# EAGLE design memoryboard4 (EAGLE 7.3.0)
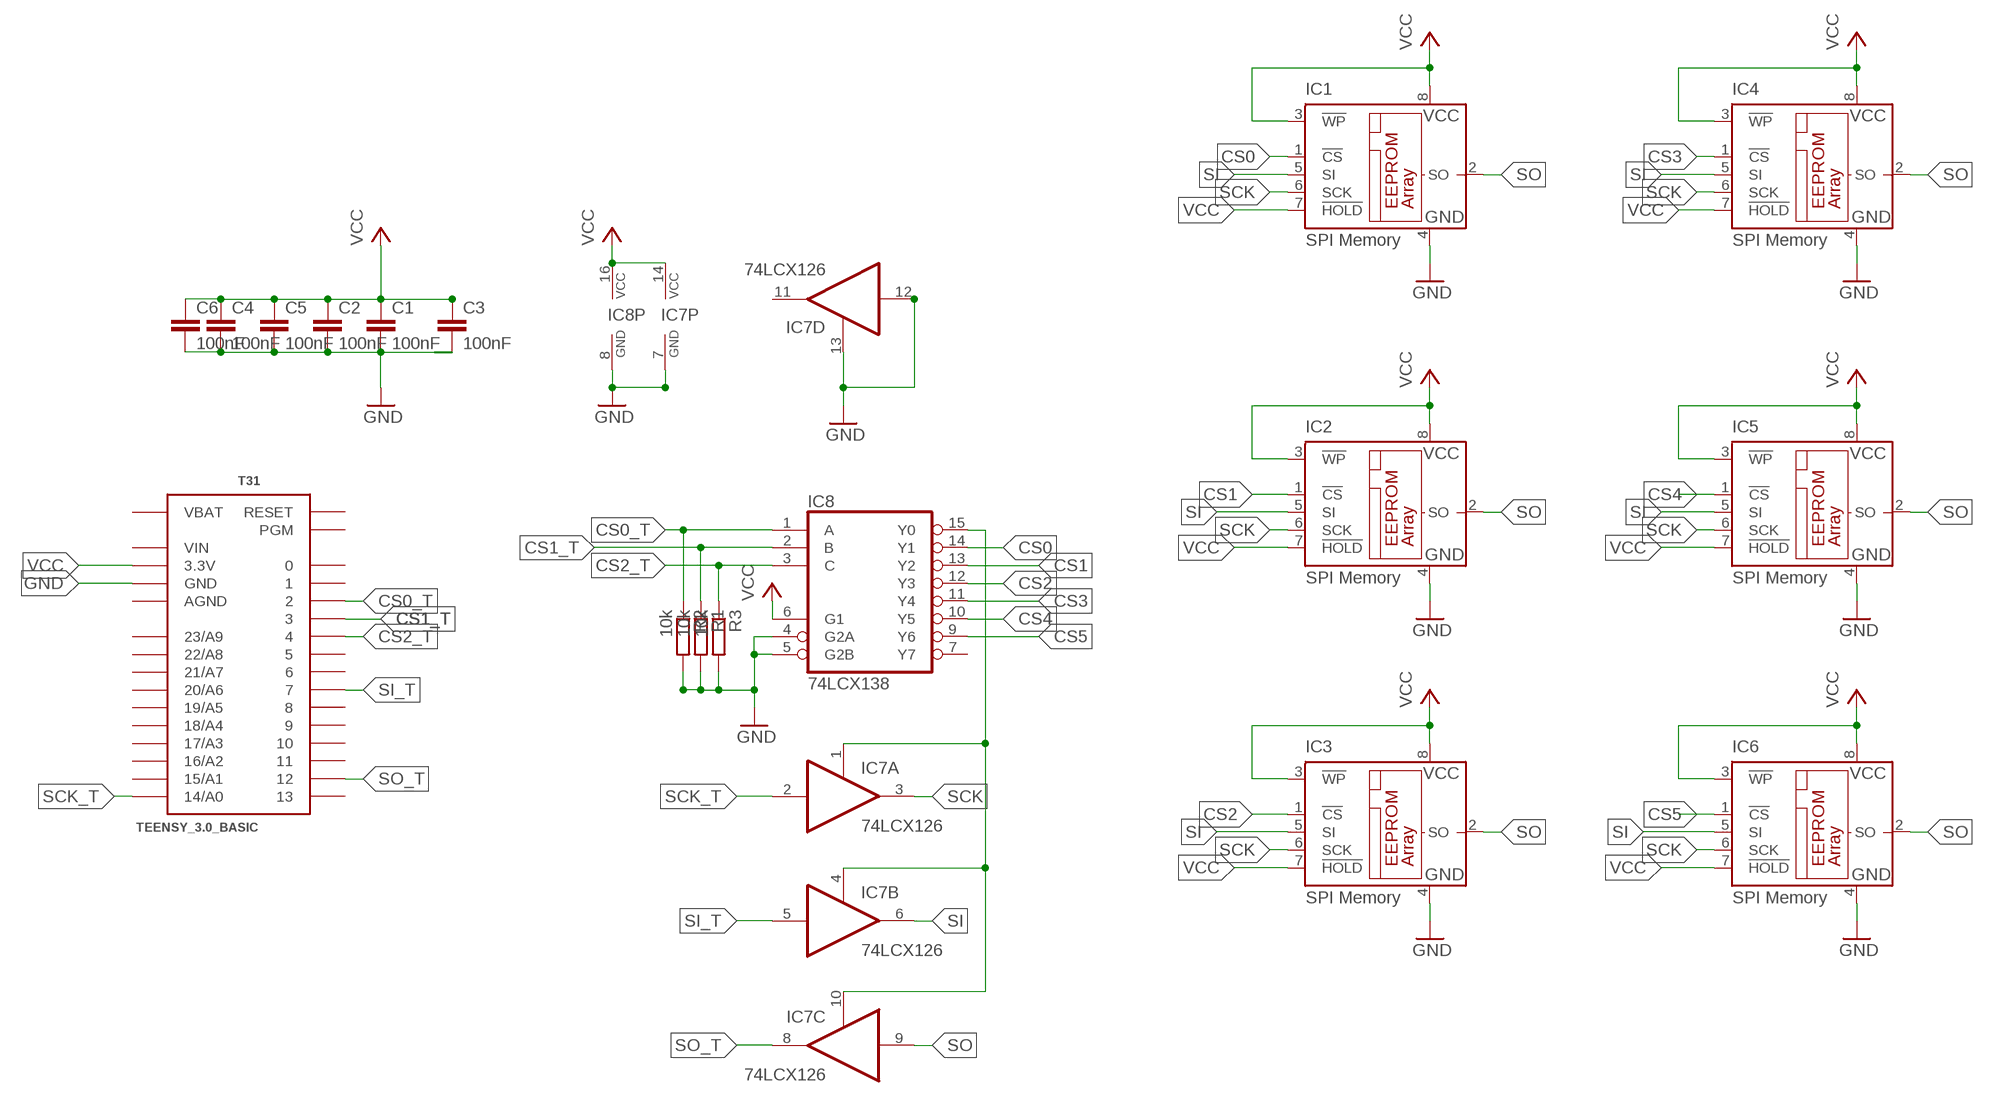
[diagram p0: schematic, sheet 1]

## Parts
C1  100nF  C-EUC0603  [C0603]
C2  100nF  C-EUC0603  [C0603]
C3  100nF  C-EUC0603  [C0603]
C4  100nF  C-EUC0603  [C0603]
C5  100nF  C-EUC0603  [C0603]
C6  100nF  C-EUC0603  [C0603]
IC1  SPI Memory  25C080SN  [SO-08]
IC2  SPI Memory  25C080SN  [SO-08]
IC3  SPI Memory  25C080SN  [SO-08]
IC4  SPI Memory  25C080SN  [SO-08]
IC5  SPI Memory  25C080SN  [SO-08]
IC6  SPI Memory  25C080SN  [SO-08]
IC7  74LCX126  74AC126D  [SO14]
IC8  74LCX138  74HC138D  [SO16]
R1  10k  R-EU_R0603  [R0603]
R2  10k  R-EU_R0603  [R0603]
R3  10k  R-EU_R0603  [R0603]
T31  TEENSY_3.0_BASIC  [TEENSY_3.0_BASIC]

## Nets
CS0: IC1.1(!CS) IC8.14(Y1)
CS0_T [SLOW]: IC8.1(A) R2.1 T31.2
CS1: IC2.1(!CS) IC8.13(Y2)
CS1_T [SLOW]: IC8.2(B) R1.1 T31.3
CS2: IC3.1(!CS) IC8.12(Y3)
CS2_T [SLOW]: IC8.3(C) R3.1 T31.4
CS3: IC4.1(!CS) IC8.11(Y4)
CS4: IC5.1(!CS) IC8.10(Y5)
CS5: IC6.1(!CS) IC8.9(Y6)
GND [SUPPLY]: C1.2 C2.2 C3.2 C4.2 C5.2 C6.2 IC1.4(GND) IC2.4(GND) IC3.4(GND) IC4.4(GND) IC5.4(GND) IC6.4(GND) IC7.7(P:GND) IC7.12(D:I) IC7.13(D:OE) IC8.4(G2A) IC8.5(G2B) IC8.8(GND) R1.2 R2.2 R3.2 T31.GND T31.GND1(GND)
SCK: IC1.6(SCK) IC2.6(SCK) IC3.6(SCK) IC4.6(SCK) IC5.6(SCK) IC6.6(SCK) IC7.3(A:O)
SCK_T: IC7.2(A:I) T31.14/A0
SI: IC1.5(SI) IC2.5(SI) IC3.5(SI) IC4.5(SI) IC5.5(SI) IC6.5(SI) IC7.6(B:O)
SI_T: IC7.5(B:I) T31.7
SO: IC1.2(SO) IC2.2(SO) IC3.2(SO) IC4.2(SO) IC5.2(SO) IC6.2(SO) IC7.9(C:I)
SO_T: IC7.8(C:O) T31.12
SPI_ENABLE: IC7.1(A:OE) IC7.4(B:OE) IC7.10(C:OE) IC8.15(Y0)
VCC [SUPPLY]: C1.1 C2.1 C3.1 C4.1 C5.1 C6.1 IC1.3(!WP) IC1.7(!HOLD) IC1.8(VCC) IC2.3(!WP) IC2.7(!HOLD) IC2.8(VCC) IC3.3(!WP) IC3.7(!HOLD) IC3.8(VCC) IC4.3(!WP) IC4.7(!HOLD) IC4.8(VCC) IC5.3(!WP) IC5.7(!HOLD) IC5.8(VCC) IC6.3(!WP) IC6.7(!HOLD) IC6.8(VCC) IC7.14(P:VCC) IC8.6(G1) IC8.16(VCC) T31.3.3V T31.3.3V1(3.3V)
Unconnected: IC7.11(D:O) IC8.7(Y7) T31.0 T31.1 T31.5 T31.6 T31.8 T31.9 T31.10 T31.11 T31.13 T31.15/A1 T31.16/A2 T31.17/A3 T31.18/A4 T31.19/A5 T31.20/A6 T31.21/A7 T31.22/A8 T31.23/A9 T31.PGM T31.RESET

## Power pins joined to a net without a drawn wire
AGND: T31.AGND
VBAT: T31.VBAT
VIN: T31.VIN

## Library data of the parts
C1-C6 = resistor:C-EU: CAPACITOR, European symbol
IC1-IC6 = microchip:25*: Serial EEPROM 4K/ 8K , SPI bus; MF: MICROCHIP; MPN: 25C080/SN; OC_FARNELL: unknown; OC_NEWARK: 96K4086
IC7 = 74xx-eu:74*126: Quad bus BUFFER, 3-state
IC8 = 74xx-eu:74*138: 3-line to 8-line DECODER/DEMULTIPLEXER
R1-R3 = resistor:R-EU_: RESISTOR, European symbol
T31 = Teensy_3_Series_Board_v1.0:TEENSY_3.0_BASIC: Basic Teensy 3.0 with none of the 'inner' pins enabled. See '+4', 'AllAnalogPins", and 'AllPins' packages for additional pin holes, as needed.

## Net classes
0 default: clearance 0.205 mm
1 SUPPLY: width 0.254 mm
2 SLOW: width 0.152 mm

## Board
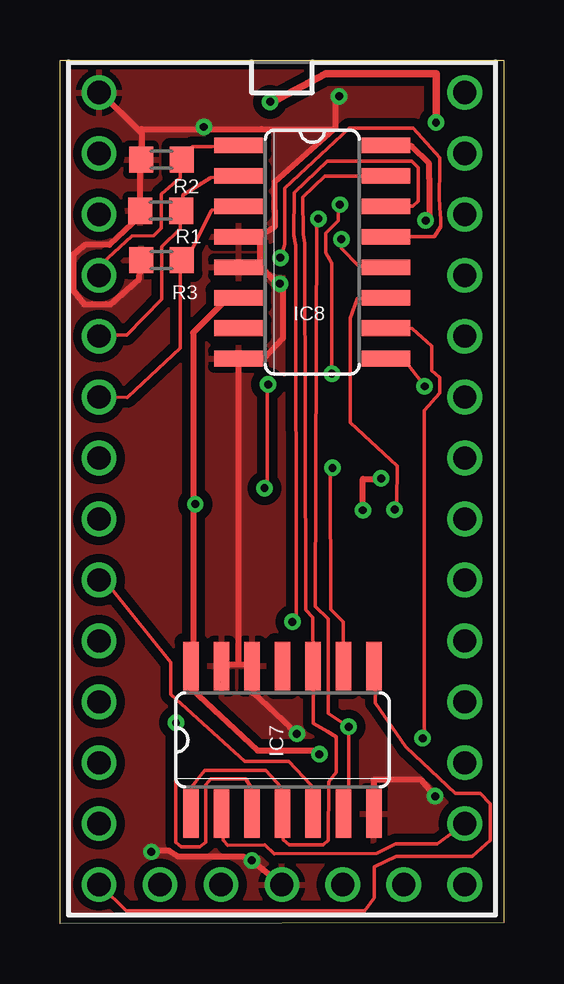
[diagram p1: board, top side]
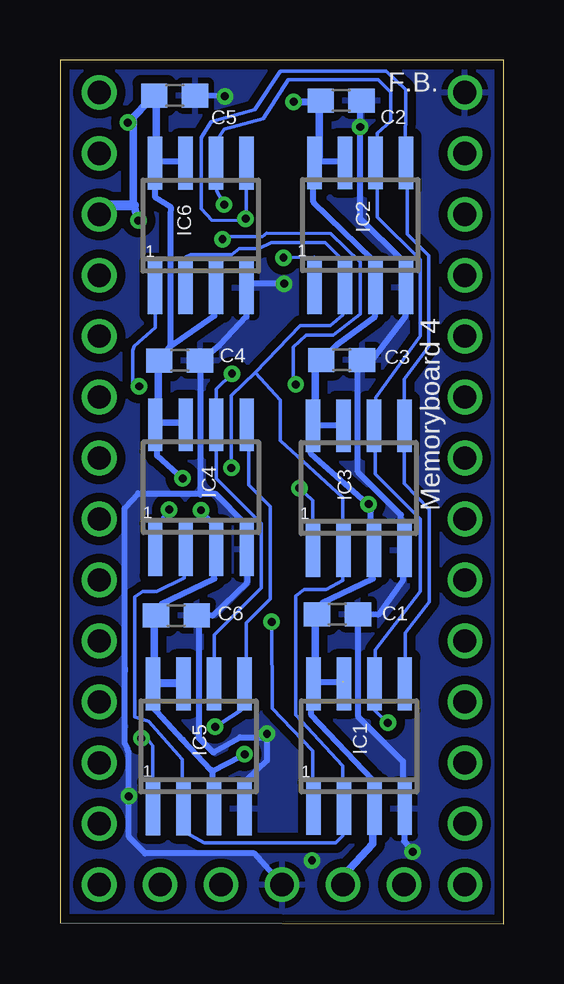
[diagram p2: board, bottom side, seen from below]

Size 18.5 x 36.02 mm. Coordinates in mm from the lower left corner, seen from the top.
Outline: 0,36.01 18.48,36.02 18.5,0.05 0.01,0 0,36.01
Copper layers (1*16): Top 0.0356mm / dielectric 1.5011mm / Bottom 0.0356mm
Design rules "LaenPCBOrder *": minimum track width 6mil, minimum drill 13mil, track to track 6mil, track to pad 6mil, pad to pad 8mil, via to via 6mil, smd to smd 6mil, copper to edge 15mil, drill to drill 6mil, minimum pad ring 7mil, minimum via ring 7mil, stop-mask expansion 3mil, vias tented up to drill 25mil, thermal gap 10mil

### Footprints (pad centres in the part's own frame; a part is rotated, then mirrored left to right if it is on the bottom)
C0603 = smd 1.1 x 1: 1 -0.85,0; 2 0.85,0
SO-08 = smd 0.6 x 2.2: 1 -1.905,-2.6; 2 -0.635,-2.6; 3 0.635,-2.6; 4 1.905,-2.6; 5 1.905,2.6; 6 0.635,2.6; 7 -0.635,2.6; 8 -1.905,2.6
SO14 = smd 0.66 x 2.032: 1 -3.81,-3.073; 2 -2.54,-3.073; 3 -1.27,-3.073; 4 0,-3.073; 5 1.27,-3.073; 6 2.54,-3.073; 7 3.81,-3.073; 8 3.81,3.073; 9 2.54,3.073; 10 1.27,3.073; 11 0,3.073; 12 -1.27,3.073; 13 -2.54,3.073; 14 -3.81,3.073
SO16 = smd 0.66 x 2.032: 1 -4.445,-3.073; 2 -3.175,-3.073; 3 -1.905,-3.073; 4 -0.635,-3.073; 5 0.635,-3.073; 6 1.905,-3.073; 7 3.175,-3.073; 8 4.445,-3.073; 9 4.445,3.073; 10 3.175,3.073; 11 1.905,3.073; 12 0.635,3.073; 13 -0.635,3.073; 14 -1.905,3.073; 15 -3.175,3.073; 16 -4.445,3.073
R0603 = smd 1 x 1.1: 1 -0.85,0; 2 0.85,0
TEENSY_3.0_BASIC = drill 0.965: 0 -7.62,13.97; 1 -7.62,11.43; 2 -7.62,8.89; 3 -7.62,6.35; 3.3V 7.62,11.43; 3.3V1 -2.54,-16.51; 4 -7.62,3.81; 5 -7.62,1.27; 6 -7.62,-1.27; 7 -7.62,-3.81; 8 -7.62,-6.35; 9 -7.62,-8.89; 10 -7.62,-11.43; 11 -7.62,-13.97; 12 -7.62,-16.51; 13 7.62,-16.51; 14/A0 7.62,-13.97; 15/A1 7.62,-11.43; 16/A2 7.62,-8.89; 17/A3 7.62,-6.35; 18/A4 7.62,-3.81; 19/A5 7.62,-1.27; 20/A6 7.62,1.27; 21/A7 7.62,3.81; 22/A8 7.62,6.35; 23/A9 7.62,8.89; AGND 7.62,13.97; GND -7.62,16.51; GND1 0,-16.51; PGM 2.54,-16.51; RESET 5.08,-16.51; VBAT -5.08,-16.51; VIN 7.62,16.51

### Placement (x,y rotation side)
C1  6.94,12.91 0 bottom
C2  6.78,34.33 0 bottom
C3  6.76,23.52 0 bottom
C4  13.51,23.48 0 bottom
C5  13.72,34.53 0 bottom
C6  13.65,12.85 0 bottom
IC1  6.04,7.41 0 bottom
IC2  5.98,29.13 0 bottom
IC3  6.05,18.17 0 bottom
IC4  12.62,18.21 0 bottom
IC5  12.72,7.4 0 bottom
IC6  12.63,29.11 0 bottom
IC7  9.27,7.67 0 top
IC8  10.51,28.01 270 top
R1  4.2,29.73 180 top
R2  4.23,31.86 180 top
R3  4.23,27.67 180 top
T31  9.25,18.15 0 top

### Tracks (layer width: path | path; a pad name or v marks a point on that pad's centre or on a via)
CS0  (via drill 0.33)
  Top 0.152: v9.68,12.6 9.83,12.78 9.82,28.28 9.75,28.71 9.76,30.48 11.13,31.8 14.66,31.8 14.93,31.53 14.93,30.14 14.71,29.92 IC8.14
  Bottom 0.152: v9.68,12.6 9.66,8.99 7.96,7.21 7.96,4.81 IC1.1
CS0_T
  Top 0.152: IC8.1 7.42,32.42 6.33,32.4 5.51,32.4 R2.1 5.01,31.8 5.01,31.12 4.22,30.43 4.22,29 3.91,28.7 2.98,28.67 1.73,27.52 1.7,27.06 T31.2
CS1  (via drill 0.33)
  Top 0.152: v9.18,27.78 9.34,28.26 9.37,28.33 9.36,30.67 12.06,33.16 14.72,33.16 15.82,31.94 15.82,31.48 15.81,30.32 15.81,29.86 15.87,29.38 15.87,29.2 15.87,29.07 15.6,28.66 13.51,28.66 IC8.13
  Bottom 0.152: v9.18,27.78 7.91,27.8 IC2.1
CS1_T
  Top 0.152: IC8.2 7.42,31.17 6.29,31.12 5.12,30.38 5.1,29.74 R1.1 5.01,29.65 5.01,28.98 4.24,28.24 4.24,26.06 2.79,24.55 2.08,24.55 1.7,24.56 T31.3
CS2  (via drill 0.33)
  Top 0.152: v11.73,28.55 11.73,28.28 11.73,28.17 12.46,27.42 13.5,27.42 IC8.12 | v8.52,18.17 8.61,18.27 8.63,18.4 8.63,22.11 v8.67,22.49
  Bottom 0.152: v11.73,28.55 11.73,28.66 10.08,28.66 9.88,28.79 7.22,28.77 5.99,27.6 5.99,25.43 7.12,24.56 8.24,24.56 8.78,24.05 8.78,22.79 v8.67,22.49 | v8.52,18.17 7.96,17.66 7.96,15.63 IC3.1
CS2_T
  Top 0.152: IC8.3 7.42,29.83 6.33,29.76 5.4,27.94 5.1,27.69 R3.1 5.01,27.6 5.01,24.01 2.8,21.95 1.7,21.97 T31.4
CS3  (via drill 0.33)
  Top 0.152: v13.95,17.27 14.04,17.56 14.05,19.08 12.1,20.91 12.1,25.26 12.38,26.08 13.5,26.08 IC8.11
  Bottom 0.152: v13.95,17.27 14.45,16.64 14.48,15.63 IC4.1
CS4  (via drill 0.33)
  Top 0.152: v15.11,7.74 15.19,8.02 15.18,21.4 15.82,22.12 15.82,22.79 15.49,23.07 15.49,24.09 14.67,24.82 14.06,24.84 13.59,24.92 IC8.10
  Bottom 0.152: v15.11,7.74 14.88,7.75 14.63,7.43 IC5.1
CS5  (via drill 0.33)
  Top 0.152: v15.2,22.41 14.3,23.58 IC8.9
  Bottom 0.152: v15.2,22.41 15.46,22.54 15.46,23.91 15.4,24.08 14.52,24.86 IC6.1
GND  (via drill 0.33)
  Top 0.254: 7.42,10.8 7.96,10.8 IC7.12 8.05,10.71 8.05,9.63 9.59,8.19 v9.87,7.93 | 7.42,10.8 6.8,10.8 IC7.13 | 9.28,26.47 9.28,24.41 8.5,23.58 7.51,23.58 IC8.8 7.42,23.49 7.42,10.8 | 9.28,26.47 8.4,27.33 7.51,27.33 IC8.5 8.34,27.45 8.34,28.61 IC8.4 7.51,28.67 8.35,28.67 8.94,29.06 8.94,30.49 8.94,30.92 11.4,33.14 | v9.16,26.69 v9.14,26.69 9.28,26.47 | R3.2 3.31,27.6 3.31,27.24 3.3,26.88 2.11,25.84 1,25.84 0.54,26.4 0.54,27.9 1.06,28.31 2.06,28.31 3.32,29.5 R1.2 3.31,29.74 3.31,31.8 R2.2 3.4,31.98 3.4,32.96 3.31,33.05 | 3.31,33.05 1.7,34.66 T31.GND | 11.4,33.14 8.41,33.14 5.99,33.14 | 5.99,33.14 3.4,33.14 3.31,33.05 | v15.63,5.32 15.04,6.01 13.06,6.01 IC7.7 | v5.99,33.23 5.99,33.14 | v3.8,3.01 3.96,3.06 4.54,3.06 4.92,2.8 7.64,2.8 v8,2.65 T31.GND1 | v11.63,34.5 11.48,34.28 11.48,33.18 11.4,33.14
  Bottom 0.254: v9.87,7.93 9.88,6.82 10.73,6 10.73,4.81 IC5.4 | v9.16,26.69 10.74,26.69 IC6.4 10.73,26.44 10.73,25.32 11.84,24.13 12.6,23.49 C4.2 12.64,17.89 | 12.6,34.39 C5.2 v11.63,34.5 | 1.7,34.75 T31.GND | v15.63,5.32 15.63,3.64 14.95,2.94 10.4,2.94 9.3,1.69 T31.GND1 9.12,1.6 | 15.64,5.34 15.64,7.15 15.69,7.32 15.81,7.54 15.81,8.29 15.8,9.67 15.8,10.68 15.81,10.5 15.81,17.33 15.24,17.95 12.6,17.95 12.03,17.94 10.78,16.68 10.73,15.71 IC4.4 10.73,15.54 10.7,14.24 12.15,12.84 12.76,12.85 C6.2 12.72,12.65 12.72,7.76 12.11,7.15 10.99,7.78 9.98,7.78 | C2.2 5.99,34.3 v5.99,33.23 5.99,29.41 4.23,27.67 4.21,26.62 IC2.4 4.12,26.53 4.12,25.32 5.47,23.55 6.08,23.55 C3.2 6.08,23.31 6.08,18.84 4.3,17.06 4.3,15.63 IC3.4 4.21,15.54 4.21,14.33 5.24,12.88 5.55,12.89 C1.2 6.08,12.59 6.08,8.66 4.21,6.78 4.21,4.81 IC1.4 4.2,4.77 | 4.3,4.72 4.2,4.77 | 4.2,4.77 4.16,3.46 v3.8,3.01
  pour Top (isolate 0.356): 0.07,35.93 18.28,35.87 18.26,0.29 0.12,0.16
  pour Bottom (isolate 0.356): 0.1,35.9 18.31,35.9 18.31,0.14 0.2,0.14
SCK  (via drill 0.33)
  Top 0.152: v4.83,8.39 4.83,3.41 5.05,3.22 5.81,3.22 6.08,3.41 6.08,5.8 6.29,6.05 7.74,6.05 7.96,5.68 7.96,4.64 IC7.3 | v11.66,29.99 11.6,29.83 11.6,29.32 11.07,28.79 11.07,27.98 11.32,27.54 v11.33,22.94
  Bottom 0.152: IC5.6 12.07,10.09 12.07,12.05 10.1,14.02 10.1,16.7 11.98,18.57 IC4.6 11.98,20.9 11.98,22.29 v11.33,22.94 | v4.83,8.39 5.39,8.9 5.37,10 IC1.6 5.37,10.09 5.37,11.43 3.49,13.86 3.49,16.88 5.37,18.75 5.37,20.72 IC3.6 5.37,20.81 5.34,21.94 3.49,24.5 3.49,27.69 5.28,29.47 5.28,31.71 IC2.6 5.28,31.8 5.28,32.98 4.72,33.46 4.72,34.68 5.23,35.19 8.99,35.19 10.03,33.56 11.65,33.13 11.9,32.76 11.98,31.8 IC6.6 11.98,31.71 11.96,30.55 v11.66,29.99
SCK_T
  Top 0.152: IC7.2 6.8,4.55 6.8,3.48 6.98,3.29 8.53,3.29 8.94,2.93 13.21,2.94 13.99,3.34 15.59,3.34 15.72,3.34 T31.14/A0
SI  (via drill 0.33)
  Top 0.152: IC7.6 11.8,4.64 12.03,4.64 12.03,6.08 v12.03,8.22 11.81,8.37 11.17,8.77 11.17,12.71 10.64,13.24 10.69,29.3 v10.76,29.4
  Bottom 0.152: v12.03,8.22 11.96,8.27 11.8,8.36 10.97,8.9 10.97,9.55 10.82,9.55 10.82,10 IC5.5 10.73,10.09 10.73,12.55 9.75,13.56 9.75,17.41 10.64,18.3 10.64,20.81 IC4.5 | IC1.5 4.12,10.09 4.12,12.14 3.11,13.43 3.11,17.27 4.14,18.36 IC3.5 4.14,22.71 3.13,24.08 3.13,27.87 4.03,28.76 4.03,31.71 IC2.5 4.12,31.8 4.09,34.77 4.9,35.55 9.33,35.55 10.38,33.94 12.19,33.44 12.6,32.78 12.6,29.81 12.18,29.34 10.99,29.32 10.78,29.36 10.72,29.43 | 10.72,29.43 10.73,29.92 IC6.5 | v10.76,29.4 10.72,29.43
SI_T
  Top 0.152: IC7.5 10.46,4.64 10.46,5.77 9.52,6.78 7.7,6.78 4.62,9.56 4.62,10.91 2.13,13.98 1.8,14.34 1.65,14.36 T31.7
SO  (via drill 0.33)
  Top 0.152: v11.35,19.01 11.27,18.97 11.27,13.12 11.81,12.58 11.8,10.8 IC7.9
  Bottom 0.152: IC4.2 13.32,15.54 13.32,14.43 14.47,13.86 14.59,13.86 14.97,13.86 15.06,13.86 15.39,13.62 15.37,8.62 14.8,8.44 13.41,6.86 13.41,4.81 IC5.2 13.32,4.72 13.24,3.81 12.49,3.38 7,3.38 6.71,3.68 6.71,4.72 IC1.2 6.71,4.81 6.71,6.59 8.67,8.71 8.67,13.67 8.31,13.95 7.41,13.95 6.71,14.33 6.71,15.54 IC3.2 6.71,15.63 6.71,17.77 9.32,20.15 9.32,21.84 10.35,22.98 | v11.35,19.01 11.35,22.03 10.35,22.98 | 10.35,22.98 8.49,24.94 7.25,24.94 6.71,25.38 6.71,26.53 IC2.2 6.71,26.62 6.71,27.67 7.44,28.4 9.7,28.41 10.21,28.15 11.02,28.15 11.35,27.9 13.05,27.89 13.23,27.81 13.23,26.53 IC6.2
SO_T
  Top 0.152: IC7.8 13.14,10.71 13.14,9.22 14.4,7.38 16.47,5.44 17.5,5.44 17.93,5.02 17.93,3.49 17.19,2.82 14.01,2.82 13.1,2.37 13.1,1.09 12.7,0.54 2.76,0.54 1.7,1.6 T31.12
SPI_ENABLE
  Top 0.152: IC7.1 5.55,4.64 5.47,5.69 6.03,6.41 8.57,6.41 9.21,5.69 9.21,4.64 IC7.4 9.3,4.55 9.3,3.5 9.56,3.3 10.96,3.3 11.18,3.49 11.2,5.93 11.5,6.31 11.5,7.81 11.15,8.03 10.59,8.34 10.55,8.35 10.55,10.71 IC7.10 10.55,10.8 10.54,12.79 10.23,13.09 10.21,28.36 10.13,28.76 10.12,30.3 11.04,31.17 13.5,31.17 IC8.15
VCC  (via drill 0.33)  (1 unrouted)
  Top 0.254: IC8.16 13.59,32.42 14.66,32.42 15.37,31.71 15.37,31.08 15.39,29.25 v15.23,29.32 | 5.55,17.5 5.55,24.65 6.98,26.08 7.42,26.08 IC8.6 | 5.55,17.5 5.55,10.8 IC7.14 5.46,10.62 5.46,9.82 8.23,7.23 9.83,7.23 10.6,7.23 v10.8,7.08 | v13.38,18.57 13.1,18.55 12.62,18.55 12.62,17.45 v12.62,17.25 | v5.64,17.5 5.55,17.5
  Top 0.305: v15.67,33.41 15.67,35.44 11.07,35.44 9.11,34.4 v8.76,34.28
  Bottom 0.254: 7.69,31.98 7.87,31.8 IC2.8 7.69,31.8 6.71,31.8 IC2.7 6.6,31.73 6.6,31.79 7.94,31.8 7.94,30.09 5.46,27.69 5.46,26.62 IC2.3 5.37,26.53 5.37,25.33 6.93,24.17 7.23,23.86 7.83,23.53 7.69,23.4 C3.1 7.87,23.31 | 7.69,34.3 C2.1 | 7.87,20.81 IC3.8 7.78,20.81 6.71,20.81 IC3.7 8.02,20.79 8.04,19.6 5.72,17.54 | 5.46,4.72 IC1.3 5.46,4.9 5.46,6.01 8.04,8.74 8.04,10.08 6.7,10.09 6.7,10.01 IC1.7 | 6.69,2.02 T31.3.3V1 | 7.87,12.68 C1.1 7.56,13.38 5.46,14.39 5.46,15.54 IC3.3 5.55,15.63 5.55,17.23 5.72,17.54 | 7.87,10.09 IC1.8 7.78,10.09 6.71,10.09 6.7,10.04 | 14.39,20.99 14.48,20.9 IC4.8 14.3,20.9 13.32,20.9 IC4.7 13.33,20.81 13.33,20.91 14.45,20.92 14.45,19.9 14.45,19.52 v13.38,18.57 | 14.39,23.4 C4.1 | IC6.3 12.07,26.44 12.07,25.35 13.92,24.06 C4.1 | 14.48,34.3 C5.1 | 14.48,31.8 IC6.8 | IC6.7 13.32,31.8 14.39,31.8 IC6.8 | 15.42,29.96 15.39,29.99 | 15.39,29.99 15.42,29.96 | 16.8,29.56 T31.3.3V | C4.1 14.3,23.5 13.9,24.11 13.9,28.16 13.9,29.55 13.89,29.88 14.52,30.29 IC6.8 | 12.16,6.36 12.21,6.43 13.35,7.65 13.38,7.68 14.69,9.11 14.7,9.71 14.7,10 13.32,10 IC5.7 13.41,10.09 14.48,10.09 IC5.8 14.57,10.09 | 12.16,6.36 12.16,4.81 IC5.3 | 14.57,12.59 C6.1 14.26,13.34 12.07,14.39 12.07,15.54 IC4.3 11.98,15.71 12,16.53 12.75,17.32 v12.62,17.25 | 12.16,6.36 10.98,6.97 v10.8,7.08 | v5.64,17.5 5.72,17.54 | 7.69,34.25 7.72,34.2 | v15.67,33.41 15.44,33.64 | 15.44,30.16 15.39,29.99
  Bottom 0.305: 7.69,31.98 7.69,34.3 | 7.87,20.81 7.87,23.31 | 5.46,4.72 5.46,3.33 6.69,2.02 | 7.87,10.09 7.87,12.68 | 14.39,20.99 14.39,23.4 | 14.48,31.8 14.48,34.3 | 14.57,10.09 14.57,12.59 | v15.23,29.32 15.42,29.96 | v15.67,33.41 C5.1 | v8.76,34.28 7.69,34.25 | 15.44,33.64 15.44,30.16
  Bottom 0.406: 16.8,29.56 16.5,29.96 15.42,29.96

### Text on the board
bPlace: F.B. | 1 | 1 | Memoryboard 4 | 1 | 1 | 1 | 1